# Altium schematic sheet QSPI.SchDoc: QSPI
size A4; Project: STM32H7-DK; Date: Not used; ApprovedBy: Not used; CheckedBy: Not used; Author: Not used; CompanyName: STMicroelectronics; DrawnBy: Not used; Engineer: Not used; Organization: Not used; Address1: Not used; Address2: Not used; Address3: Not used; Address4: Not used; DocumentNumber: Not used; Revision: Not used; SheetNumber: 9; SheetTotal: 16; CurrentTime: Not used; CurrentDate: Not used; Time: Not used; DocumentFullPathAndName: Not used; DocumentName: Not used; ModifiedDate: Not used; ImagePath: Not used; ProjectName: Not used; Application_BuildNumber: Not used
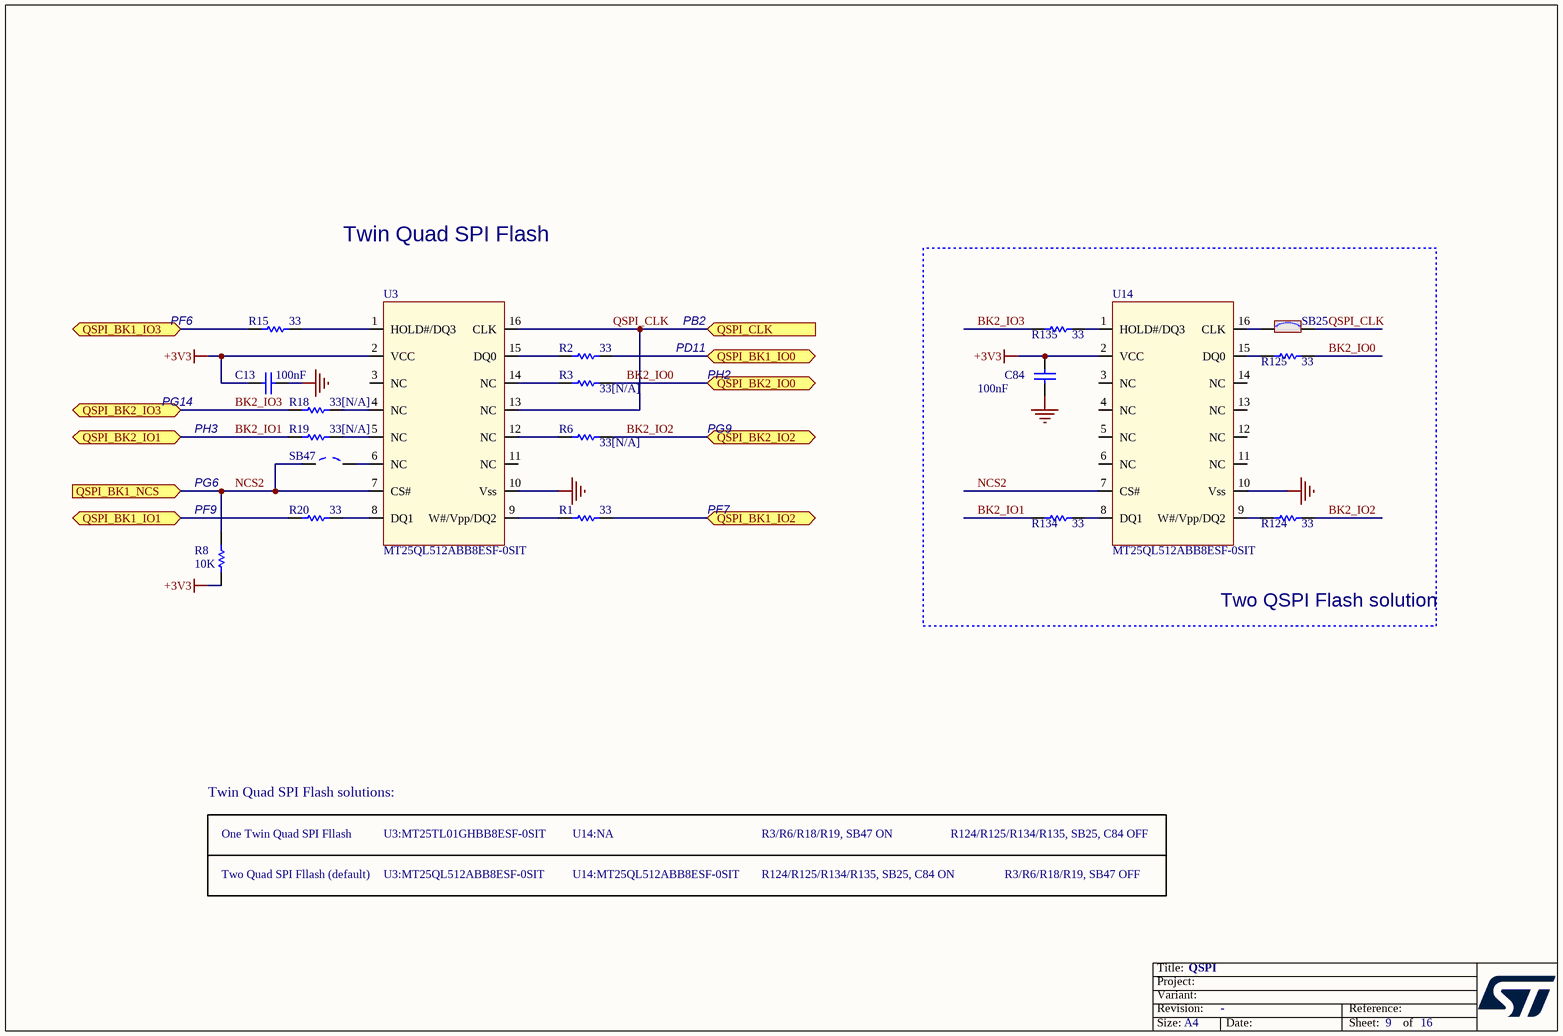
[diagram p0: QSPI.SchDoc]

## Parts
C13  100nF  [0603C]
C84  100nF  [0402C]
R1  33  [0603R]
R2  33  [0603R]
R3  33[N/A]  [0603R]
R6  33[N/A]  [0603R]
R8  10K  [0603R]
R15  33  [0603R]
R18  33[N/A]  [0603R]
R19  33[N/A]  [0603R]
R20  33  [0603R]
R124  33  [0603R]
R125  33  [0603R]
R134  33  [0603R]
R135  33  [0603R]
SB25  Solder Bridge ON  [SB_0603]  (value not drawn)
SB47  Solder Bridge OFF  [SB_0603]  (value not drawn)
U3  MT25QL512ABB8ESF-0SIT  [SOIC16W_1R27_10R3X10R33]
U14  MT25QL512ABB8ESF-0SIT  [SOIC16W_1R27_10R3X10R33]

## Blocks framed on the sheet
Two QSPI Flash solution: C84 R124 R125 R134 R135 SB25 U14

## Ports
QSPI_BK1_IO0 (bidir), QSPI_BK1_IO1 (bidir), QSPI_BK1_IO2 (bidir), QSPI_BK1_IO3 (bidir), QSPI_BK1_NCS (in), QSPI_BK2_IO0 (bidir), QSPI_BK2_IO1 (bidir), QSPI_BK2_IO2 (bidir), QSPI_BK2_IO3 (bidir), QSPI_CLK (in)

## Nets
+3V3: C13.1 C84.1 R8.2 U3.2(VCC) U14.2(VCC)
GND: C13.2 C84.2 U3.10(Vss) U14.10(Vss)
BK2_IO0: R3.1 R125.1 ; port QSPI_BK2_IO0
BK2_IO1: R19.2 R134.2 ; port QSPI_BK2_IO1
BK2_IO2: R6.1 R124.1 ; port QSPI_BK2_IO2
BK2_IO3: R18.2 R135.2 ; port QSPI_BK2_IO3
NCS2: R8.1 SB47.1 U3.7(CS#) U14.7(CS#) ; port QSPI_BK1_NCS
QSPI_BK1_IO0: R2.1 ; port QSPI_BK1_IO0
QSPI_BK1_IO1: R20.2 ; port QSPI_BK1_IO1
QSPI_BK1_IO2: R1.1 ; port QSPI_BK1_IO2
QSPI_BK1_IO3: R15.2 ; port QSPI_BK1_IO3
QSPI_CLK: SB25.2 U3.13(NC) U3.16(CLK) ; port QSPI_CLK
NetR1_2: R1.2 U3.9(W#/Vpp/DQ2)
NetR2_2: R2.2 U3.15(DQ0)
NetR3_2: R3.2 U3.14(NC)
NetR6_2: R6.2 U3.12(NC)
NetR15_1: R15.1 U3.1(HOLD#/DQ3)
NetR18_1: R18.1 U3.4(NC)
NetR19_1: R19.1 U3.5(NC)
NetR20_1: R20.1 U3.8(DQ1)
NetR124_2: R124.2 U14.9(W#/Vpp/DQ2)
NetR125_2: R125.2 U14.15(DQ0)
NetR134_1: R134.1 U14.8(DQ1)
NetR135_1: R135.1 U14.1(HOLD#/DQ3)
NetSB25_1: SB25.1 U14.16(CLK)
NetSB47_2: SB47.2 U3.6(NC)

Not connected (* = marked no-connect by the designer): U3 3(NC) 11(NC); U14 3(NC) 4(NC) 5(NC) 6(NC) 11(NC) 12(NC) 13(NC) 14(NC)

## Notes on the sheet
- Twin Quad SPI Flash
- PF6
- PD11
- PB2
- PH2
- (near C13) PG14
- PH3
- PG9
- (near R8) PF9
- PG6
- PF7
- Twin Quad SPI Flash solutions:
- One Twin Quad SPI Fllash
- U3:MT25TL01GHBB8ESF-0SIT
- U14:NA
- R3/R6/R18/R19, SB47 ON
- R124/R125/R134/R135, SB25, C84 OFF
- Two Quad SPI Fllash (default)
- U3:MT25QL512ABB8ESF-0SIT
- U14:MT25QL512ABB8ESF-0SIT
- R124/R125/R134/R135, SB25, C84 ON
- R3/R6/R18/R19, SB47 OFF
- Title:
- Project:
- Size:
- Revision:
- Variant:
- A4
- -
- Date:
- Reference:
- Sheet:
- of

## Library data of the parts
C13 C84 = Cap: Capacitor; Value: 10nF; Ordered by: Subcon; Published: 8-Jun-2000; Revision: July-2002: Re-released for DXP Platform.; Publisher: Altium Limited
R1 R2 R15 R20 R124 R125 R134 R135 = Res1: Resistor; Value: 1K; Published: 8-Jun-2000; Revision: July-2002: Re-released for DXP Platform.; Publisher: Altium Limited
R3 R6 R18 R19 = Res1: Resistor; Value: 1K; Fitted: NO; Published: 8-Jun-2000; Revision: July-2002: Re-released for DXP Platform.; Publisher: Altium Limited
R8 = res1: Resistor; Value: 1K; Ordered by: Subcon; Published: 8-Jun-2000; Revision: July-2002: Re-released for DXP Platform.; Publisher: Altium Limited
SB25 = SB_ON: Fitted: YES; Ordered by: Subcon; Revision: July-2002: Re-released for DXP Platform.; ECCN_US/EU: n/a
SB47 = SB_OFF: Fitted: NO; Ordered by: Subcon; Revision: July-2002: Re-released for DXP Platform.; ECCN_US/EU: n/a
U3 U14 = QSPI_16pins: ECCN_US/EU: 3A991